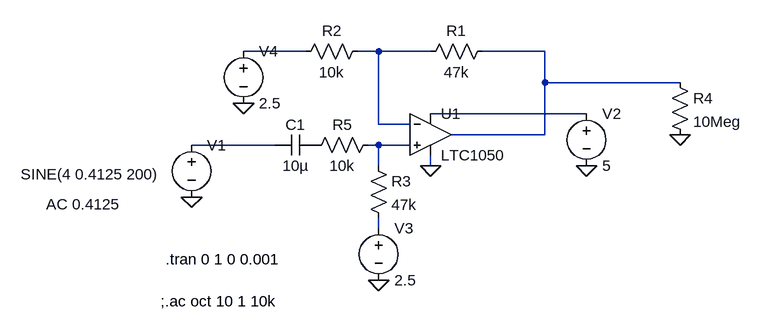
[diagram p0: schematic phototransistor-amplifier.asc]
phototransistor-amplifier.asc, the LTspice schematic file:
Version 4
SHEET 1 1392 680
WIRE 208 -192 112 -192
WIRE 320 -192 288 -192
WIRE 400 -192 320 -192
WIRE 576 -192 480 -192
WIRE 576 -144 576 -192
WIRE 784 -144 576 -144
WIRE 640 -96 400 -96
WIRE 320 -80 320 -192
WIRE 368 -80 320 -80
WIRE 576 -64 576 -144
WIRE 576 -64 432 -64
WIRE 160 -48 32 -48
WIRE 320 -48 304 -48
WIRE 368 -48 320 -48
WIRE 320 -16 320 -48
WIRE 400 -16 400 -32
WIRE 320 80 320 64
FLAG 32 32 0
FLAG 784 -64 0
FLAG 640 -16 0
FLAG 400 -16 0
FLAG 320 160 0
FLAG 112 -112 0
SYMBOL cap 224 -64 R90
WINDOW 0 0 32 VBottom 2
WINDOW 3 32 32 VTop 2
SYMATTR InstName C1
SYMATTR Value 10µ
SYMBOL voltage 32 -64 R0
WINDOW 3 -263 61 Left 2
WINDOW 123 -224 107 Left 2
WINDOW 39 0 0 Left 2
SYMATTR Value SINE(4 0.4125 200)
SYMATTR Value2 AC 0.4125
SYMATTR InstName V1
SYMBOL voltage 640 -112 R0
WINDOW 123 0 0 Left 2
WINDOW 39 0 0 Left 2
SYMATTR InstName V2
SYMATTR Value 5
SYMBOL res 496 -208 R90
WINDOW 0 0 56 VBottom 2
WINDOW 3 32 56 VTop 2
SYMATTR InstName R1
SYMATTR Value 47k
SYMBOL res 304 -208 R90
WINDOW 0 0 56 VBottom 2
WINDOW 3 32 56 VTop 2
SYMATTR InstName R2
SYMATTR Value 10k
SYMBOL res 768 -160 R0
SYMATTR InstName R4
SYMATTR Value 10Meg
SYMBOL voltage 320 64 R0
WINDOW 123 0 0 Left 2
WINDOW 39 0 0 Left 2
SYMATTR InstName V3
SYMATTR Value 2.5
SYMBOL res 304 -32 R0
SYMATTR InstName R3
SYMATTR Value 47k
SYMBOL res 320 -64 R90
WINDOW 0 0 56 VBottom 2
WINDOW 3 32 56 VTop 2
SYMATTR InstName R5
SYMATTR Value 10k
SYMBOL voltage 112 -208 R0
WINDOW 123 0 0 Left 2
WINDOW 39 0 0 Left 2
SYMATTR InstName V4
SYMATTR Value 2.5
SYMBOL Opamps\\LTC1050 400 -128 R0
SYMATTR InstName U1
TEXT -16 192 Left 2 !;.ac oct 10 1 10k
TEXT -8 128 Left 2 !.tran 0 1 0 0.001

The netlist it stands for:
* phototransistor-amplifier.asc
C1 P001 N005 10µ
V1 N005 0 SINE(4 0.4125 200) AC 0.4125
V2 N004 0 5
R1 N003 N002 47k
R2 N002 N001 10k
R4 N003 0 10Meg
V3 N007 0 2.5
R3 N006 N007 47k
R5 N006 P001 10k
V4 N001 0 2.5
XU1 N006 N002 N004 0 N003 LTC1050  ; pins In+ In- V+ V- OUT
;.ac oct 10 1 10k
.tran 0 1 0 0.001
.lib LTC.lib
.backanno
.end